# EAGLE design Lab 6 CTD (EAGLE 9.6.2)
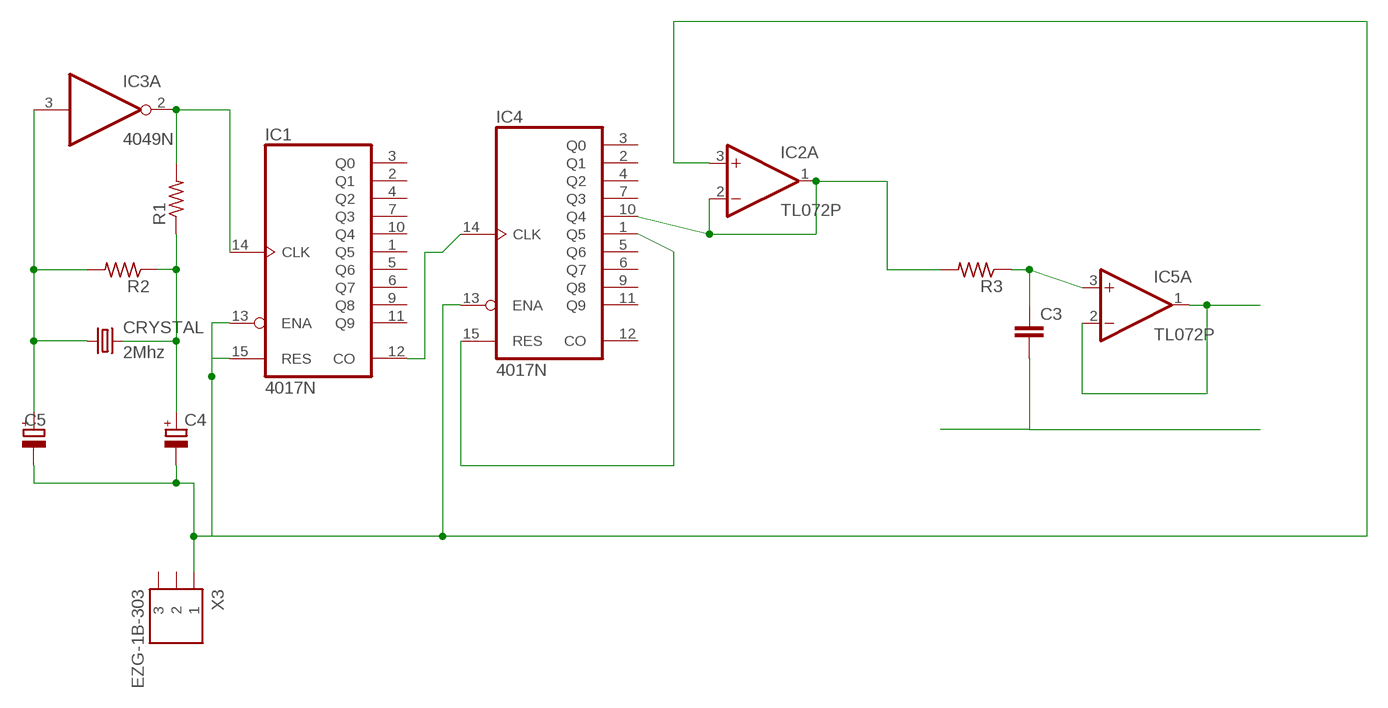
[diagram p0: schematic, sheet 1]

## Parts
C3  C-EU050-025X075  [C050-025X075]
C4  CPOL-EUB45181A  [B45181A]
C5  CPOL-EUB45181A  [B45181A]
CRYSTAL  2Mhz  CRYSTALHC49U-V  [HC49U-V]
IC1  4017N  [DIL16]
IC2  TL072P  [DIL08]
IC3  4049N  [DIL16]
IC4  4017N  [DIL16]
IC5  TL072P  [DIL08]
R1  R-US_0411/15  [0411/15]
R2  R-US_0411/15  [0411/15]
R3  R-US_0411/15  [0411/15]
X3  EZG-1B-303  [EZG-1B-1K-303]

## Nets
N$1: IC1.14(CLK) IC3.2(A:O) R1.2
N$2: IC1.12(CO) IC4.14(CLK)
N$3: IC4.1(Q5) IC4.15(RES)
N$4: C4.+ CRYSTAL.2 R1.1 R2.1
N$5: C5.+ CRYSTAL.1 IC3.3(A:I) R2.2
N$6: IC2.1(A:OUT) IC2.2(A:-IN) IC4.10(Q4) R3.2
N$7: C3.1 IC5.3(A:+IN) R3.1
N$8: IC5.1(A:OUT) IC5.2(A:-IN)
N$9: C3.2
N$10: C4.- C5.- IC1.13(ENA) IC1.15(RES) IC2.3(A:+IN) IC4.13(ENA) X3.1
Unconnected: IC1.1(Q5) IC1.2(Q1) IC1.3(Q0) IC1.4(Q2) IC1.5(Q6) IC1.6(Q7) IC1.7(Q3) IC1.9(Q8) IC1.10(Q4) IC1.11(Q9) IC2.5(B:+IN) IC2.6(B:-IN) IC2.7(B:OUT) IC3.4(B:O) IC3.5(B:I) IC3.6(C:O) IC3.7(C:I) IC3.9(D:I) IC3.10(D:O) IC3.11(E:I) IC3.12(E:O) IC3.14(F:I) IC3.15(F:O) IC4.2(Q1) IC4.3(Q0) IC4.4(Q2) IC4.5(Q6) IC4.6(Q7) IC4.7(Q3) IC4.9(Q8) IC4.11(Q9) IC4.12(CO) IC5.5(B:+IN) IC5.6(B:-IN) IC5.7(B:OUT) X3.2 X3.3

## Power pins joined to a net without a drawn wire
V+: IC2.8(P:V+) IC5.8(P:V+)
V-: IC2.4(P:V-) IC5.4(P:V-)
VDD: IC1.16(VDD) IC3.1(P:VDD) IC4.16(VDD)
VSS: IC1.8(VSS) IC3.8(P:VSS) IC4.8(VSS)

## Library data of the parts
C3 = rcl:C-EU: CAPACITOR, European symbol; SPICEPREFIX: C
C4 C5 = rcl:CPOL-EU: POLARIZED CAPACITOR, European symbol; SPICEPREFIX: C
CRYSTAL = crystal:CRYSTAL: CRYSTAL; OC_FARNELL: 1666969; OC_NEWARK: unknown
IC1 IC4 = 40xx:4017: COUNTER/DIVIDER
IC2 IC5 = linear:TL072: OP AMP
IC3 = 40xx:4049: Hex inverting BUFFER
R1-R3 = resistor:R-US_: RESISTOR, American symbol
X3 = con-lemo:EZG-?-303: LEMO Connector Source: http://www.lemo.com/pdfs/catalog/ROW/German/unipole_multipole.pdf; OC_FARNELL: unknown; OC_NEWARK: unknown

## Board
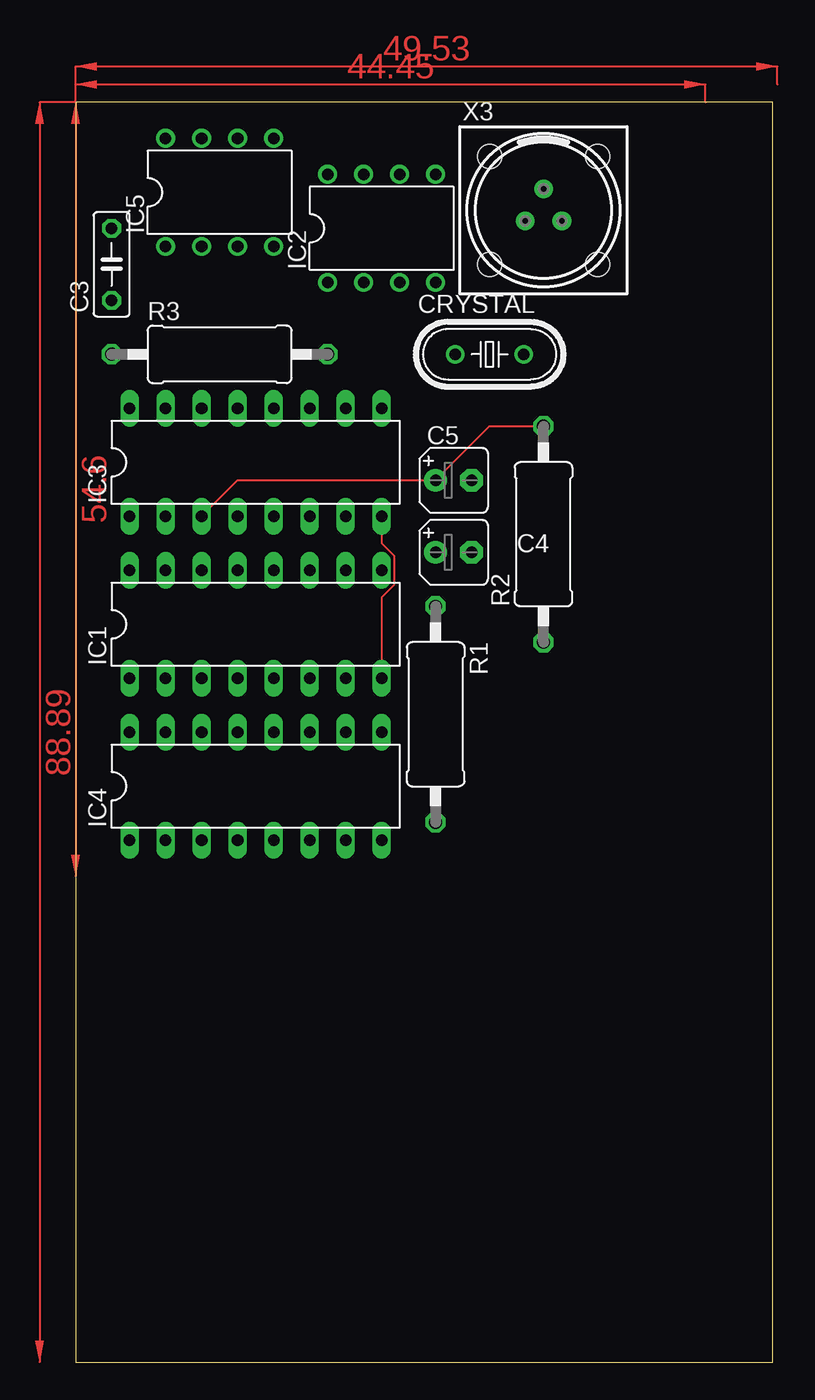
[diagram p1: board, top side]
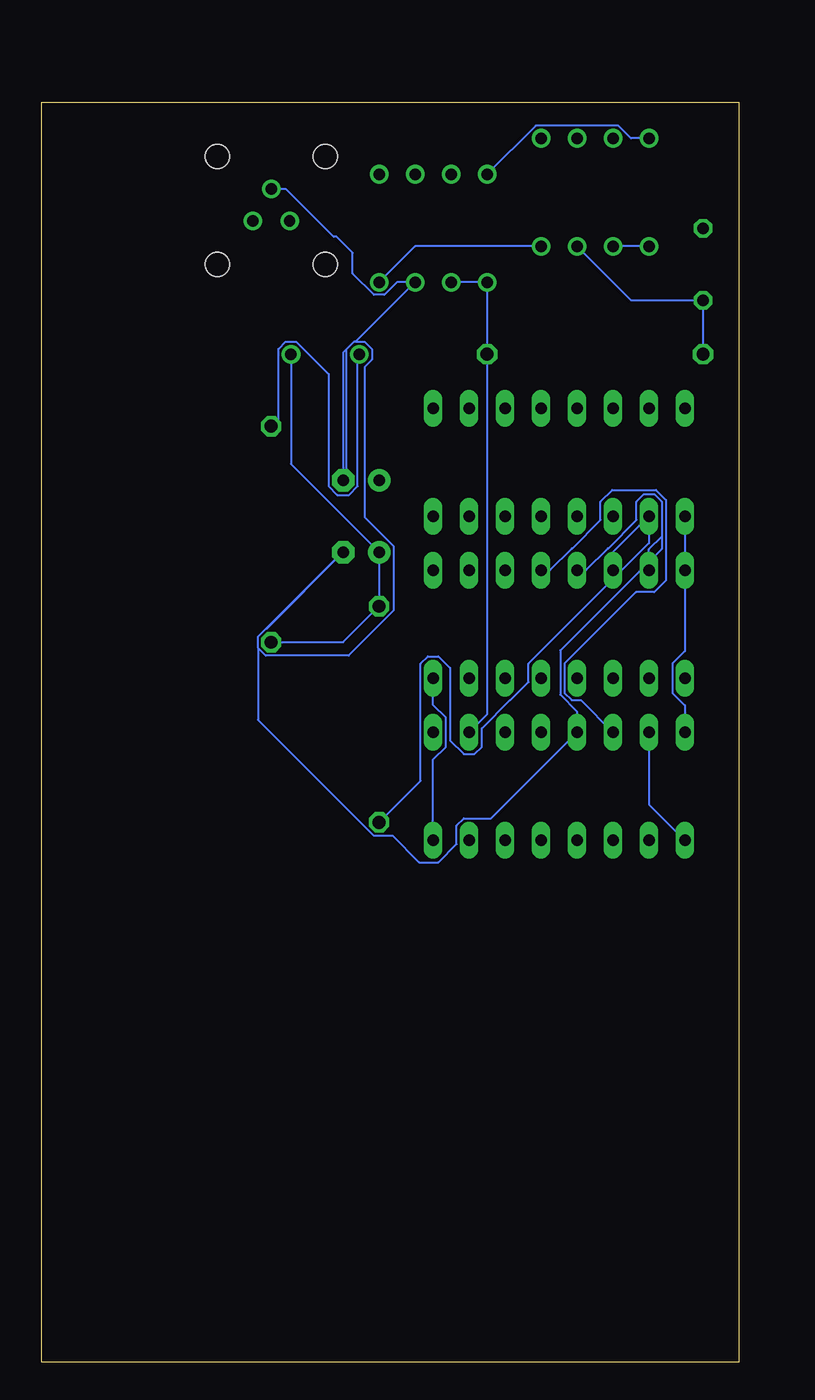
[diagram p2: board, bottom side, seen from below]

Size 49.2 x 88.89 mm. Coordinates in mm from the lower left corner, seen from the top.
Outline: 0,0 49.2,0 49.2,88.89 0,88.89 0,0
Copper layers (1*16): Top 0.035mm / dielectric 1.5mm / Bottom 0.035mm
Design rules "default": minimum track width 6mil, minimum drill 0.35mm, track to track 6mil, track to pad 6mil, pad to pad 6mil, via to via 6mil, smd to smd 6mil, copper to edge 40mil, drill to drill 6mil, minimum pad ring 10mil, minimum via ring 8mil, stop-mask expansion 4mil, vias tented up to drill 0mil, thermal gap 10mil

### Footprints (pad centres in the part's own frame; a part is rotated, then mirrored left to right if it is on the bottom)
C050-025X075 = drill 0.813 octagon: 1 -2.54,0; 2 2.54,0
B45181A = drill 0.813 pad 1.6: + -1.27,0 | drill 0.813 pad 1.6 octagon: - 1.27,0
HC49U-V = drill 0.813: 1 -2.413,0; 2 2.413,0
DIL16 = drill 0.813 long: 1 -8.89,-3.81; 2 -6.35,-3.81; 3 -3.81,-3.81; 4 -1.27,-3.81; 5 1.27,-3.81; 6 3.81,-3.81; 7 6.35,-3.81; 8 8.89,-3.81; 9 8.89,3.81; 10 6.35,3.81; 11 3.81,3.81; 12 1.27,3.81; 13 -1.27,3.81; 14 -3.81,3.81; 15 -6.35,3.81; 16 -8.89,3.81
DIL08 = drill 0.813 pad 1.27: 1 -3.81,-3.81; 2 -1.27,-3.81; 3 1.27,-3.81; 4 3.81,-3.81; 5 3.81,3.81; 6 1.27,3.81; 7 -1.27,3.81; 8 -3.81,3.81
0411/15 = drill 0.914 octagon: 1 -7.62,0; 2 7.62,0
EZG-1B-1K-303 = drill 0.8 pad 1.2: 1 0,1.5; 2 -1.299,-0.75; 3 1.299,-0.75 | hole 1.7: -3.81,3.81; 3.81,3.81; 3.81,-3.81; -3.81,-3.81

### Placement (x,y rotation side)
C3  2.54,77.47 90 top
C4  26.67,57.15 0 top
C5  26.67,62.23 0 top
CRYSTAL  29.21,71.12 0 top
IC1  12.7,52.07 0 top
IC2  21.59,80.01 0 top
IC3  12.7,63.5 0 top
IC4  12.7,40.64 0 top
IC5  10.16,82.55 0 top
R1  25.4,45.72 270 top
R2  33.02,58.42 90 top
R3  10.16,71.12 0 top
X3  33.02,81.28 0 top

### Tracks (layer width: path | path; a pad name or v marks a point on that pad's centre or on a via)
N$1
  Bottom 0.152: R1.2 22.48,41.02 22.48,49.29 21.96,49.81 21.22,49.81 20.4,48.98 20.4,43.88 19.42,42.9 18.68,42.9 18.16,43.42 18.16,44.72 16.17,46.71 16.14,46.71 14.86,47.99 14.86,49.29 8.58,55.57 | 8.58,55.57 IC1.14 8.89,57.15 IC3.2 6.35,57.8 8.58,55.57
N$2
  Bottom 0.152: IC4.14 11.15,46.71 11.8,46.71 12.32,47.23 12.32,49.29 7.28,54.33 5.98,54.33 5.16,55.16 5.16,60.84 5.86,61.54 8.95,61.54 9.78,60.72 9.78,59.42 11.77,57.43 11.8,57.43 13.35,55.88 IC1.12
N$3
  Bottom 0.152: IC4.15 6.35,39.37 IC4.1
N$4
  Bottom 0.152: CRYSTAL.2 31.62,63.37 C4.+ R1.1 27.94,50.8 R2.1
N$5
  Top 0.152: IC3.3 11.43,62.23 C5.+ 29.21,66.04 R2.2
  Bottom 0.152: R2.2 32.51,66.55 32.51,71.49 31.99,72.01 31.25,72.01 28.97,69.72 28.97,61.8 28.37,61.2 27.51,61.2 26.91,61.8 26.91,71.01 CRYSTAL.1
N$6
  Bottom 0.152: IC2.2 IC2.1 R3.2 17.78,45.72 IC4.10
N$7
  Bottom 0.152: IC5.3 7.62,74.93 C3.1 R3.1
N$8
  Bottom 0.152: IC5.1 IC5.2
N$10
  Bottom 0.152: X3.1 31.98,82.78 28.61,79.41 28.41,79.41 27.27,78.27 27.27,76.81 25.77,75.31 25.03,75.31 24.14,76.2 IC2.3 27.05,72.01 | 27.05,72.01 27.16,72.01 27.69,71.49 | 27.69,71.49 27.94,71.23 C5.- 27.69,62.48 27.69,71.49 | 33.41,51.74 33.35,51.74 C4.- 28,57.15 33.41,51.74 | 33.96,50.41 33.96,45.33 25.79,37.16 24.46,37.16 22.58,35.28 21.22,35.28 19.94,36.56 19.94,37.86 19.42,38.38 17.5,38.38 IC4.13 11.43,45.91 12.62,47.11 12.62,50.23 5.46,57.39 5.46,58.26 | IC1.15 6.35,57.37 5.46,58.26 | IC1.13 10.81,55.88 9.26,57.43 9.23,57.43 7.24,59.42 7.24,60.72 6.72,61.24 5.98,61.24 5.46,60.72 5.46,58.26 | 27.05,72.01 26.43,72.01 25.91,71.49 25.91,70.75 26.43,70.23 26.43,59.63 24.37,57.58 24.37,53.04 27.55,49.86 33.41,49.86 33.96,50.41 | 33.96,50.41 33.96,51.19 33.41,51.74
V+
  Bottom 0.152: IC5.8 7.63,86.36 8.52,87.25 14.35,87.25 IC2.8
V-
  Bottom 0.152: IC5.4 22.86,78.74 IC2.4
VDD
  Bottom 0.152: IC4.16 3.81,46.34 4.7,47.23 4.7,49.29 3.81,50.18 IC1.16 IC3.1
VSS
  Top 0.152: IC3.8 21.59,57.8 22.48,56.91 22.48,54.85 21.59,53.96 IC1.8
  Bottom 0.152: IC4.8 21.59,42.53 20.7,43.42 20.7,45.48 21.59,46.37 IC1.8
(copper drawn outside any net)
  shapes: Top area x4